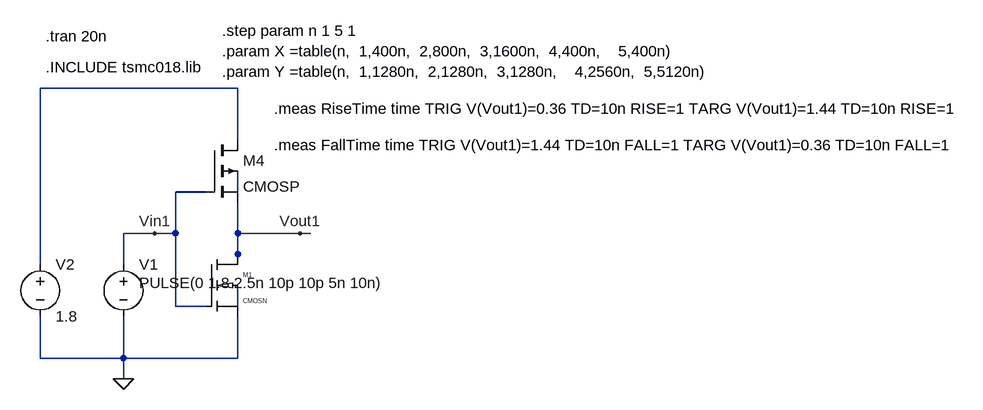
[diagram p0: schematic 1D_VTC_AC_WITHOUT_C.asc]
1D_VTC_AC_WITHOUT_C.asc, the LTspice schematic file:
Version 4
SHEET 1 2184 1940
WIRE -528 -64 -832 -64
WIRE -528 16 -528 -64
WIRE -576 96 -624 96
WIRE -528 96 -528 64
WIRE -656 160 -704 160
WIRE -624 160 -624 96
WIRE -624 160 -656 160
WIRE -528 160 -528 112
WIRE -432 160 -528 160
WIRE -416 160 -432 160
WIRE -528 192 -528 160
WIRE -832 208 -832 -64
WIRE -704 208 -704 160
WIRE -528 208 -528 192
WIRE -624 272 -624 160
WIRE -576 272 -624 272
WIRE -528 272 -528 240
WIRE -832 352 -832 288
WIRE -704 352 -704 288
WIRE -704 352 -832 352
WIRE -528 352 -528 288
WIRE -528 352 -704 352
WIRE -704 384 -704 352
FLAG -704 384 0
FLAG -656 160 Vin1
FLAG -432 160 Vout1
DATAFLAG -624 96 ""
SYMBOL voltage -704 192 R0
WINDOW 123 0 0 Left 0
WINDOW 39 0 0 Left 0
WINDOW 3 24 44 Left 2
SYMATTR Value PULSE(0 1.8 2.5n 10p 10p 5n 10n)
SYMATTR InstName V1
SYMBOL voltage -832 192 R0
WINDOW 123 0 0 Left 0
WINDOW 39 0 0 Left 0
SYMATTR InstName V2
SYMATTR Value 1.8
SYMBOL cmosn -576 192 R0
SYMATTR InstName M1
SYMATTR Value2 l=180n w=X
SYMBOL cmosp -576 16 R0
SYMATTR InstName M4
SYMATTR Value2 l=180n w=Y
TEXT -824 -96 Left 2 !.INCLUDE tsmc018.lib
TEXT -824 -144 Left 2 !.tran 20n
TEXT -552 -152 Left 2 !.step param n 1 5 1\n.param X =table(n,  1,400n,  2,800n,  3,1600n,  4,400n,    5,400n)\n.param Y =table(n,  1,1280n,  2,1280n,  3,1280n,    4,2560n,  5,5120n)
TEXT -472 -32 Left 2 !.meas RiseTime time TRIG V(Vout1)=0.36 TD=10n RISE=1 TARG V(Vout1)=1.44 TD=10n RISE=1
TEXT -472 24 Left 2 !.meas FallTime time TRIG V(Vout1)=1.44 TD=10n FALL=1 TARG V(Vout1)=0.36 TD=10n FALL=1

The netlist it stands for:
* 1D_VTC_AC_WITHOUT_C.asc
V1 Vin1 0 PULSE(0 1.8 2.5n 10p 10p 5n 10n)
V2 N001 0 1.8
M1 Vout1 Vin1 0 N003 CMOSN l=180n w=X
M4 N001 Vin1 Vout1 N002 CMOSP l=180n w=Y
.model NMOS NMOS
.model PMOS PMOS
.lib standard.mos
.INCLUDE tsmc018.lib
.tran 20n
.step param n 1 5 1
.param X =table(n,  1,400n,  2,800n,  3,1600n,  4,400n,    5,400n)
.param Y =table(n,  1,1280n,  2,1280n,  3,1280n,    4,2560n,  5,5120n)
.meas RiseTime time TRIG V(Vout1)=0.36 TD=10n RISE=1 TARG V(Vout1)=1.44 TD=10n RISE=1
.meas FallTime time TRIG V(Vout1)=1.44 TD=10n FALL=1 TARG V(Vout1)=0.36 TD=10n FALL=1
.lib tsmc018.lib
.backanno
.end

* Results of the author's LTspice run, read from the files saved beside the schematic
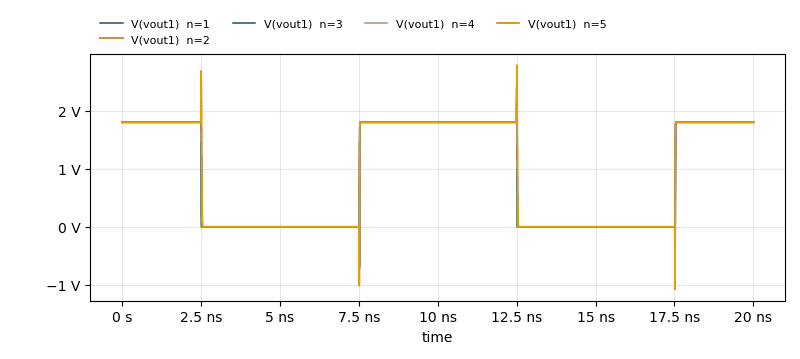
[diagram p1: Transient Analysis of 1D_VTC_AC_WITHOUT_C.asc, plotted from the saved traces]
* Transient Analysis, 5 runs:
*   V(vout1) [n=1]: min -697.2 mV, max 2.571 V, average 898.5 mV, rms 1.272 V, last 1.8 V
*   V(vout1) [n=2]: min -724 mV, max 2.499 V, average 897.6 mV, rms 1.272 V, last 1.8 V
*   V(vout1) [n=3]: min -746.3 mV, max 2.46 V, average 896.6 mV, rms 1.271 V, last 1.8 V
*   V(vout1) [n=4]: min -867.3 mV, max 2.711 V, average 899.8 mV, rms 1.273 V, last 1.8 V
*   V(vout1) [n=5]: min -1.079 V, max 2.782 V, average 902.1 mV, rms 1.275 V, last 1.8 V
* From the log:
*   Measurement: risetime
*     step  risetime  FROM  TO
*        1  6.28033e-012  1.75233e-008  1.75296e-008
*        2  7.32282e-012  1.75244e-008  1.75318e-008
*        3  1.03055e-011  1.75263e-008  1.75366e-008
*        4  4.73833e-012  1.75231e-008  1.75279e-008
*        5  4.40645e-012  1.75232e-008  1.75276e-008
*   Measurement: falltime
*     step  falltime  FROM  TO
*        1  6.64395e-012  1.25145e-008  1.25211e-008
*        2  4.9463e-012  1.2513e-008  1.25179e-008
*        3  3.56331e-012  1.2512e-008  1.25155e-008
*        4  9.79569e-012  1.25189e-008  1.25287e-008
*        5  1.65882e-011  1.25273e-008  1.25439e-008